# Altium schematic sheet Esp32.SchDoc
size A; SheetNumber: 1; SheetTotal: 1
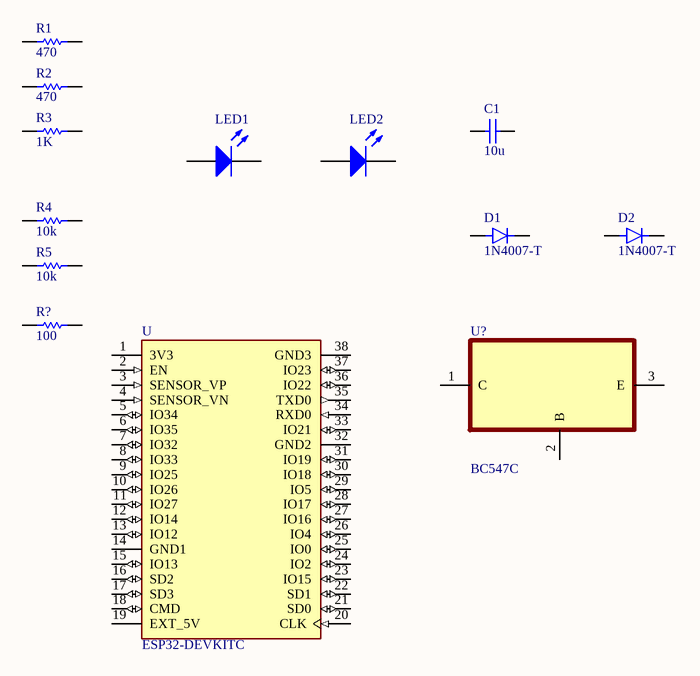
[diagram p0: Esp32.SchDoc]

## Parts
C1  value 10u  (hidden comment: Capacitor)
D1  1N4007-T  [DIOAD780W78L463D236]
D2  1N4007-T  [DIOAD780W78L463D236]
LED1  Light-Emitting Diode  (value not drawn)
LED2  Light-Emitting Diode  (value not drawn)
R1  value 470  (hidden comment: Resistor)
R2  value 470  (hidden comment: Resistor)
R3  value 1K  (hidden comment: Resistor)
R4  value 10k  (hidden comment: Resistor)
R5  value 10k  (hidden comment: Resistor)
R?  value 100  (hidden comment: Resistor)
U  ESP32-DEVKITC  [MODULE_ESP32-DEVKITC]
U?  BC547C  [TO127P254X732-3]

## Nets

Not connected (* = marked no-connect by the designer): C1 1 2; D1 A K; D2 A K; LED1 1(A) 2(K); LED2 1(A) 2(K); R1 1 2; R2 1 2; R3 1 2; R4 1 2; R5 1 2; R? 1 2; U 1(3V3) 2(EN) 3(SENSOR_VP) 4(SENSOR_VN) 5(IO34) 6(IO35) 7(IO32) 8(IO33) 9(IO25) 10(IO26) 11(IO27) 12(IO14) 13(IO12) 14(GND1) 15(IO13) 16(SD2) 17(SD3) 18(CMD) 19(EXT_5V) 20(CLK) 21(SD0) 22(SD1) 23(IO15) 24(IO2) 25(IO0) 26(IO4) 27(IO16) 28(IO17) 29(IO5) 30(IO18) 31(IO19) 32(GND2) 33(IO21) 34(RXD0) 35(TXD0) 36(IO22) 37(IO23) 38(GND3); U? 1(C) 2(B) 3(E)

## Library data of the parts
C1 = Capacitor: SimulationGenericComponent: True
D1 D2 = 1N4007-T: Diode Standard 1000 V 1A Through Hole DO-41; MF: Diodes Incorporated; SnapEDA_Link: https://www.snapeda.com/parts/1N4007-T/Diodes+Inc./view-part/?ref=snap; Package: DO-41 Diodes Inc.; Value: *; MP: 1N4007-T; Check_prices: https://www.snapeda.com/parts/1N4007-T/Diodes+Inc./view-part/?ref=eda
LED1 LED2 = LED: AF: 1; BV: 0; BV_MAX: 1e99; EG: 1.11; FC: 0.5; IBV: 0.001; IS: 1e-14; MJSW: 0.33; NTUN: 30; TNOM: 27; XTI: 3; SimulationGenericComponent: True; CJO: 0; CJP: 0; CTA: 0; CTP: 0; FCS: 0.5; FV_MAX: 1e99; IKF: 0; IKR: 0; ISR: 1e-14; JSW: 0; JTUN: 0; JTUNSW: 0; KEG: 1; KF: 0; LEVEL: 1; N: 1; NBV: 1; NR: 1; NS: 1; PHP: 1; RS: 0; TCV: 0; TLEV: 0; TLEVC: 0; TM1: 0; TM2: 0; TPB: 0; TPHP: 0; TRS: 0; TRS2: 0; TT: 0; TTT1: 0; TTT2: 0; VJ: 1; XTITUN: 3
R1-R5 R? = Resistor: TC1: 0; SimulationGenericComponent: True; TC2: 0
U = ESP32-DEVKITC: - Transceiver; 802.11 b/g/n _Wi-Fi, WiFi, WLAN_, BluetoothÂ® Smart Ready 4.x Dual Mode For Use With ESP-WROOM-32; MP: ESP32-DEVKITC-32D-F; MF: Espressif Systems; Price: None; SnapEDA_Link: https://www.snapeda.com/parts/ESP32-DEVKITC-32D-F/Espressif%20Systems/view-part/4220172/?ref=snap; Availability: Unavailable; Value: *; Package: None
U? = BC547C: Bipolar (BJT) Transistor NPN 45 V 100 mA 300MHz 625 mW Through Hole TO-92 (TO-226); MF: onsemi; SnapEDA_Link: https://www.snapeda.com/parts/BC547C/Onsemi/view-part/?ref=snap; Package: E-PKG AXIAL-LEADED-2 ON Semiconductor; Value: *; MP: BC547C; Check_prices: https://www.snapeda.com/parts/BC547C/Onsemi/view-part/?ref=eda